# EAGLE schematic ADK_MEGA_2560-REV3 (EAGLE 7.1.0)
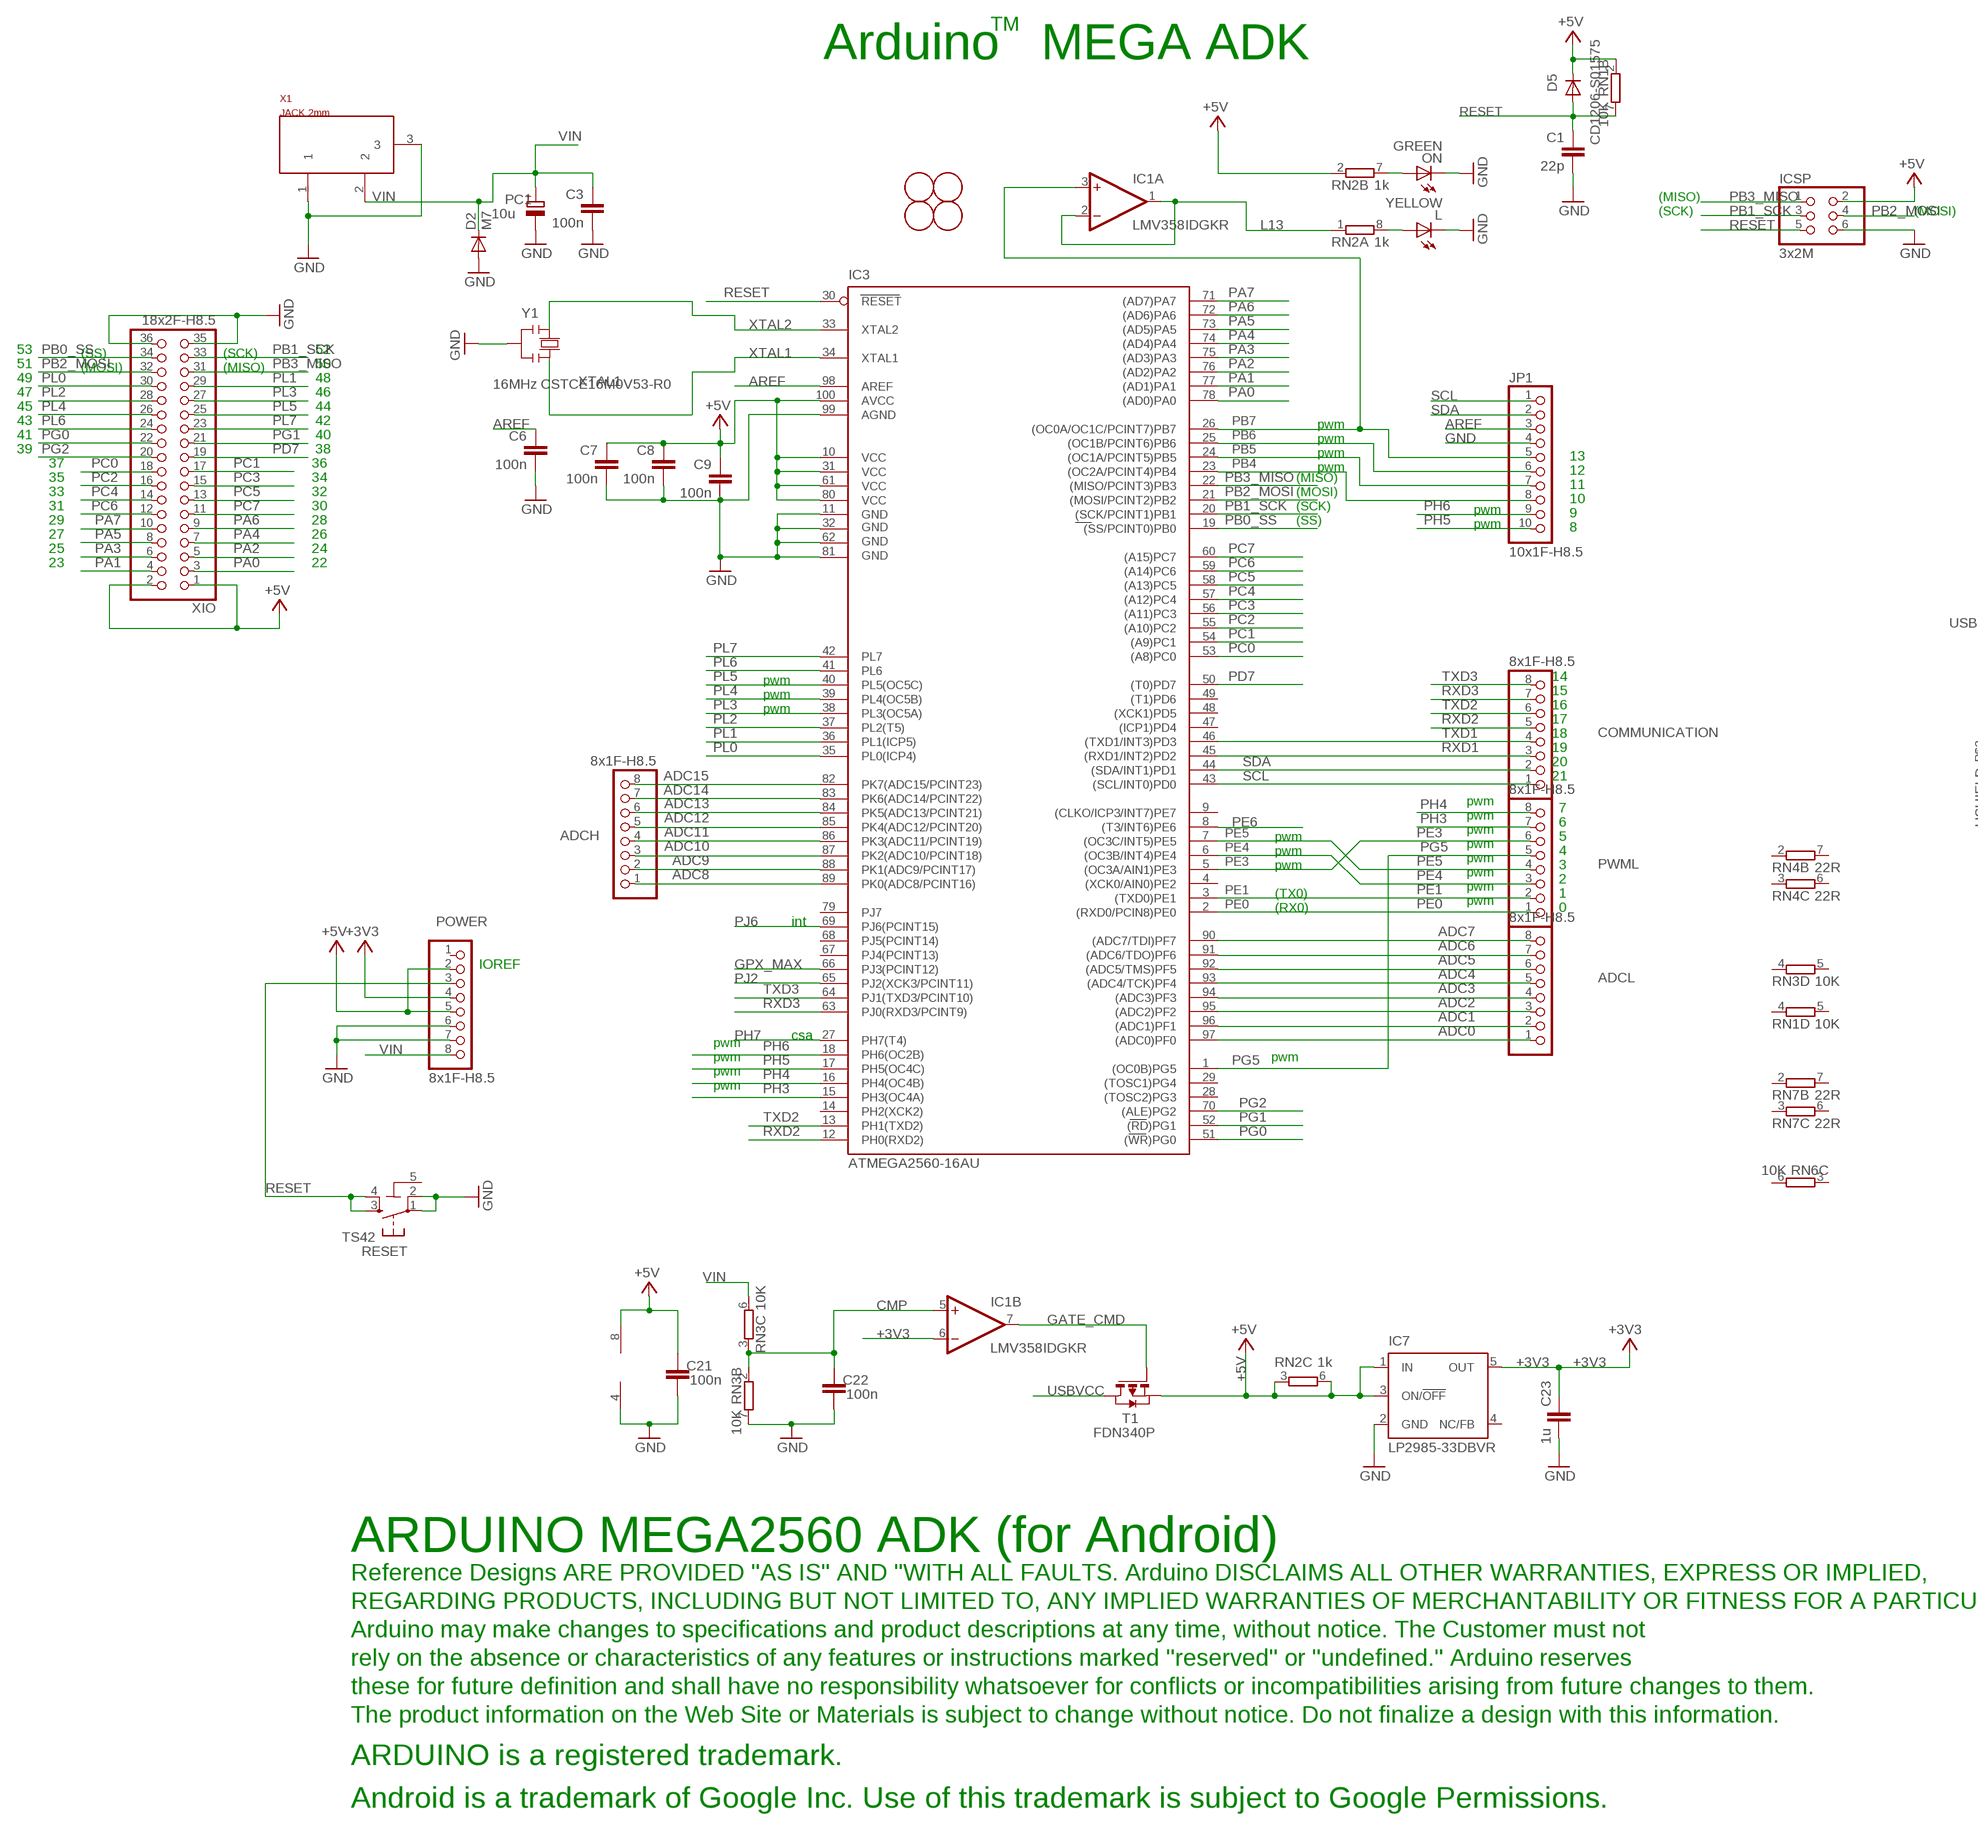
[diagram p0: schematic, sheet 1, part 1 of 2]
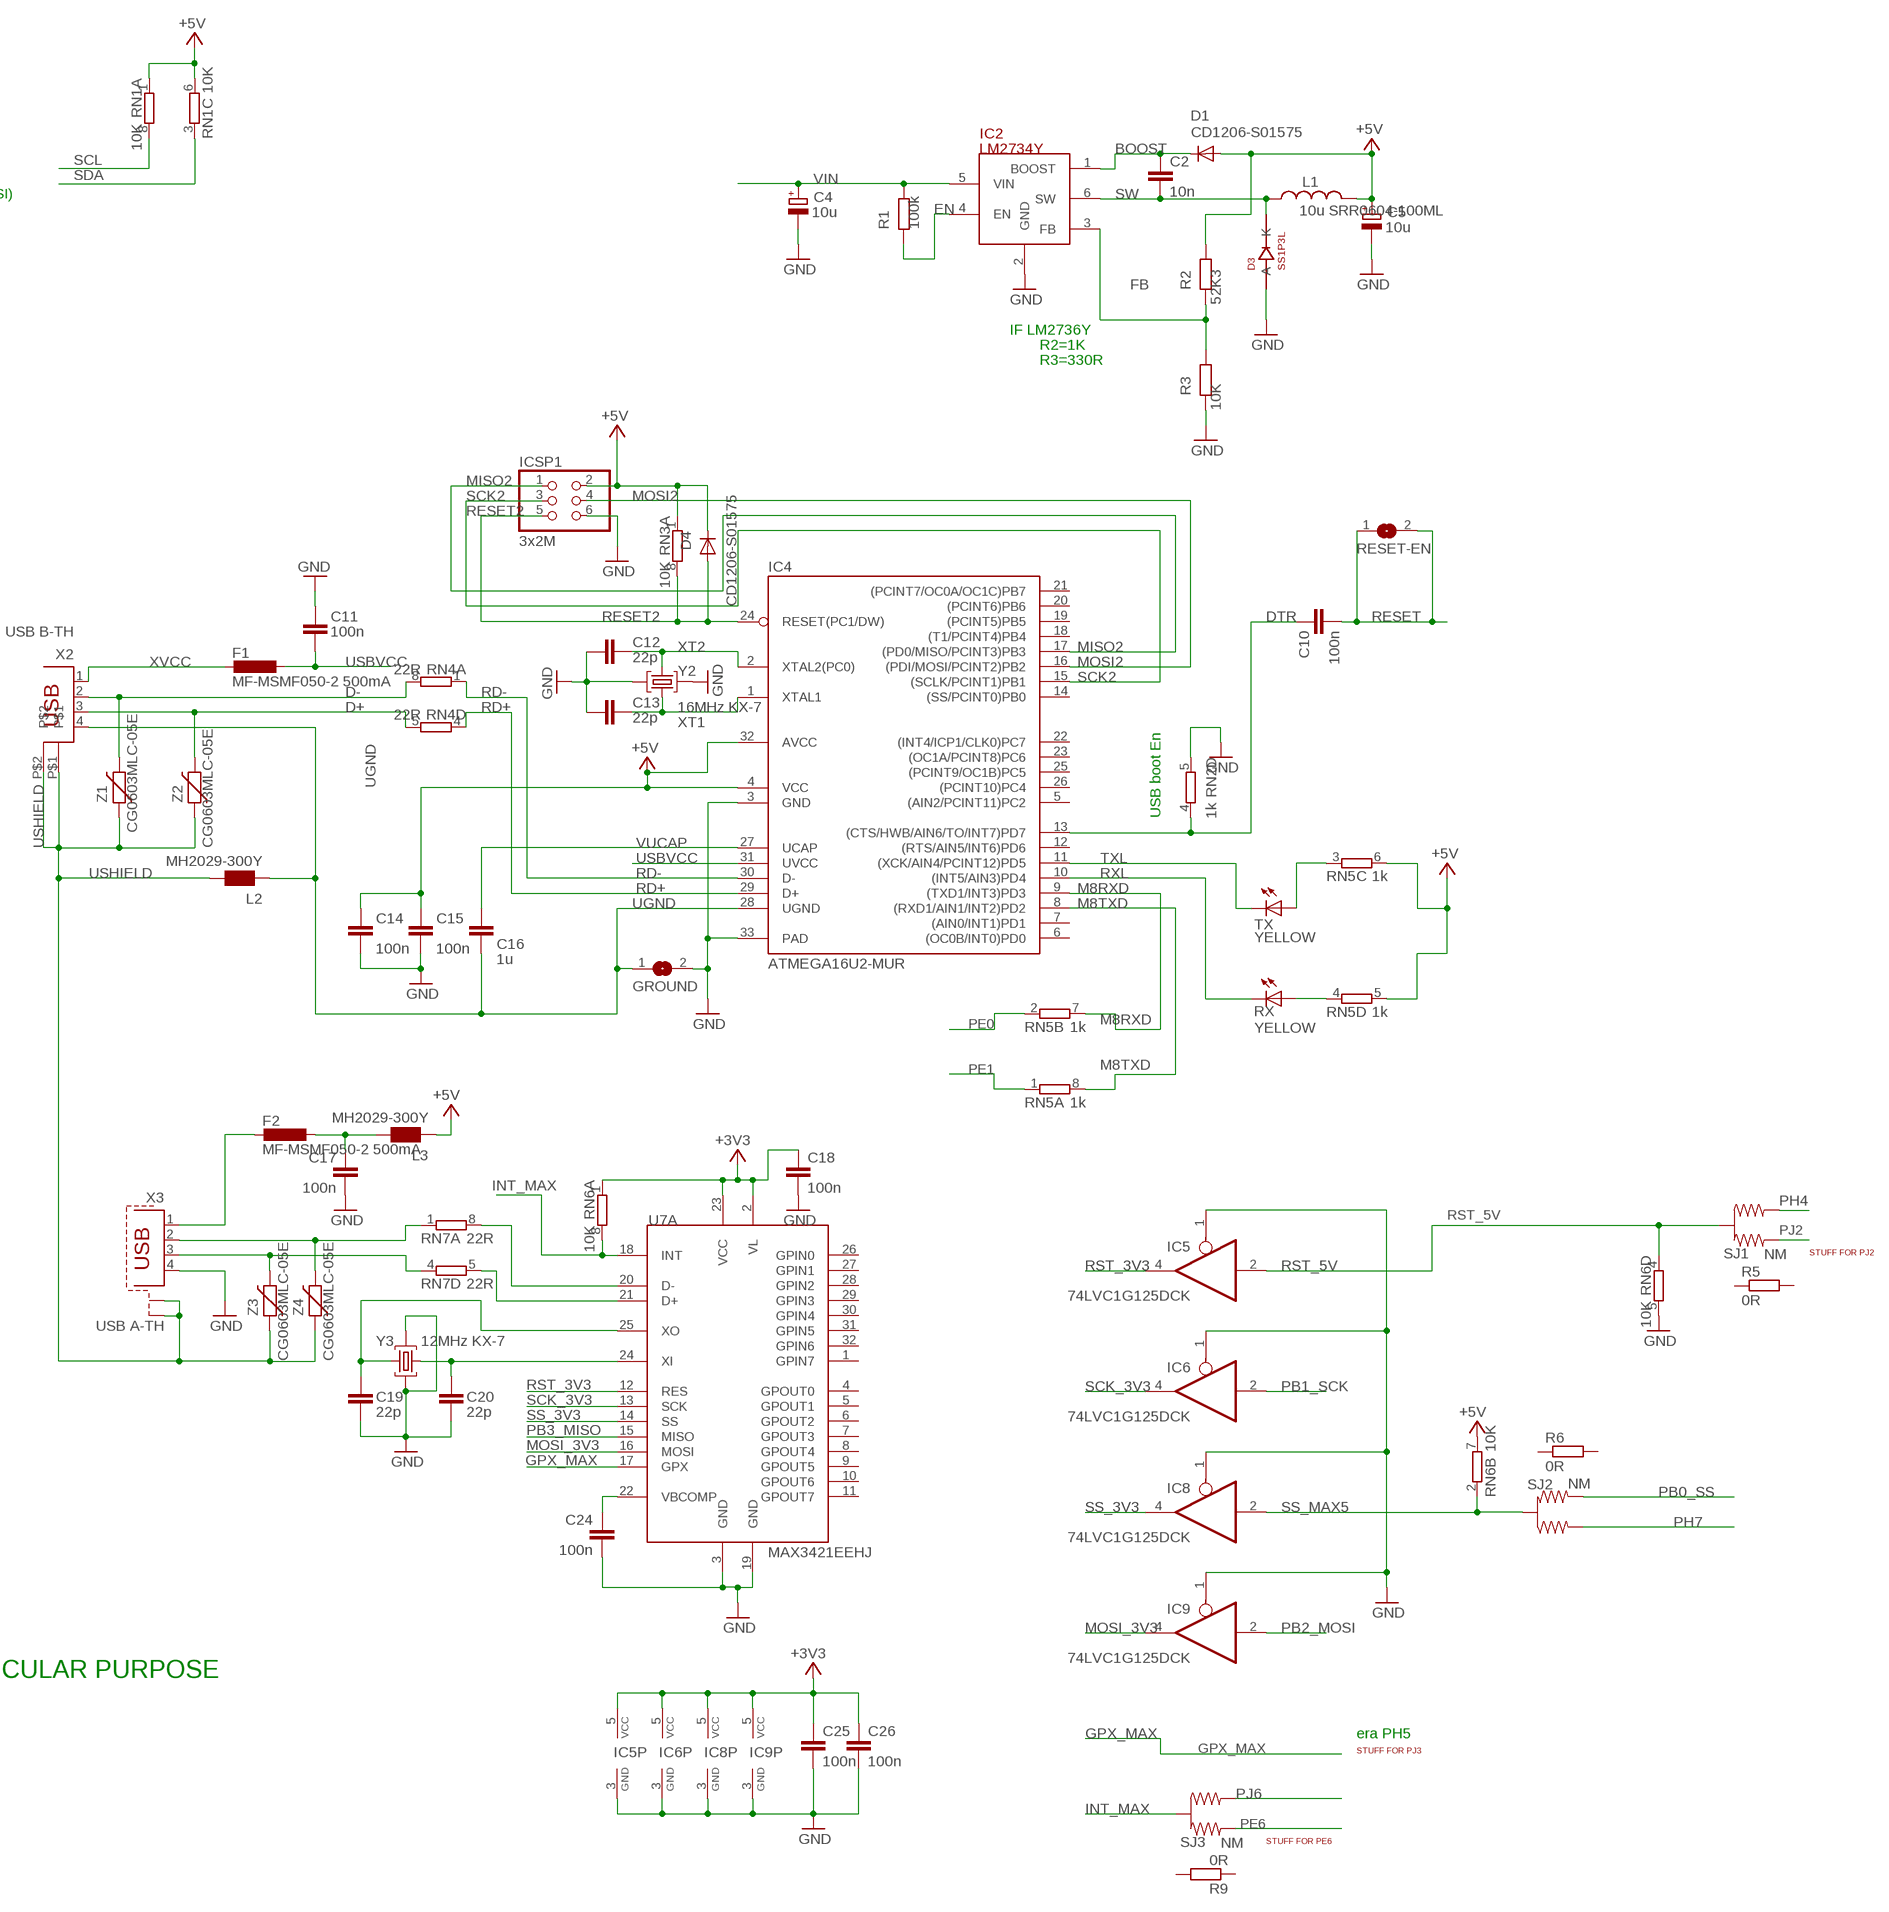
[diagram p1: schematic, sheet 1, part 2 of 2]

## Parts
ADCH  8x1F-H8.5  PINHD-1X8  [1X08]
ADCL  8x1F-H8.5  PINHD-1X8  [1X08]
C1  22p  C-EU0603-RND  [C0603-ROUND]
C2  10n  C-EUC0603  [C0603-ROUND]
C3  100n  C-EU0603-RND  [C0603-ROUND]
C4  10u  CPOL-EUSMCB  [SMC_B]
C5  10u  CPOL-EUSMCB  [SMC_B]
C6  100n  C-EU0603-RND  [C0603-ROUND]
C7  100n  C-EU0603-RND  [C0603-ROUND]
C8  100n  C-EU0603-RND  [C0603-ROUND]
C9  100n  C-EU0603-RND  [C0603-ROUND]
C10  100n  C-EU0603-RND  [C0603-ROUND]
C11  100n  C-EU0603-RND  [C0603-ROUND]
C12  22p  C-EU0603-RND  [C0603-ROUND]
C13  22p  C-EU0603-RND  [C0603-ROUND]
C14  100n  C-EU0603-RND  [C0603-ROUND]
C15  100n  C-EU0603-RND  [C0603-ROUND]
C16  1u  C-EU0603-RND  [C0603-ROUND]
C17  100n  C-EU0603-RND  [C0603-ROUND]
C18  100n  C-EU0603-RND  [C0603-ROUND]
C19  22p  C-EU0603-RND  [C0603-ROUND]
C20  22p  C-EU0603-RND  [C0603-ROUND]
C21  100n  C-EU0603-RND  [C0603-ROUND]
C22  100n  C-EU0603-RND  [C0603-ROUND]
C23  1u  C-EU0603-RND  [C0603-ROUND]
C24  100n  C-EU0603-RND  [C0603-ROUND]
C25  100n  C-EU0603-RND  [C0603-ROUND]
C26  100n  C-EU0603-RND  [C0603-ROUND]
COMMUNICATION  8x1F-H8.5  PINHD-1X8  [1X08]
D1  CD1206-S01575  DIODE-MINIMELF  [MINIMELF]
D2  M7  DIODE-SMB  [SMB]
D3  SS1P3L  [DO220AAL]
D4  CD1206-S01575  DIODE-MINIMELF  [MINIMELF]
D5  CD1206-S01575  DIODE-MINIMELF  [MINIMELF]
F1  MF-MSMF050-2 500mA  L-EUL1812  [L1812]
F2  MF-MSMF050-2 500mA  L-EUL1812  [L1812]
FID1  FIDUCIALMOUNT  [FIDUCIA-MOUNT]
FID2  FIDUCIALMOUNT  [FIDUCIA-MOUNT]
FID3  FIDUCIALMOUNT  [FIDUCIA-MOUNT]
FID4  FIDUCIALMOUNT  [FIDUCIA-MOUNT]
GROUND  SJ  [SJ]
IC1  LMV358IDGKR  LMV358MMX  [MSOP08]
IC2  LM2734Y  LM2736Y  [SOT23-6]
IC3  ATMEGA2560-16AU  ATMEGA25602560-16AU  [TQFP100]
IC4  ATMEGA16U2-MUR  ATMEGA16U2-MU  [MLF32]
IC5  74LVC1G125DCK  [SC70-5]
IC6  74LVC1G125DCK  [SC70-5]
IC7  LP2985-33DBVR  LP2985-XXDBVR33  [SOT23-DBV]
IC8  74LVC1G125DCK  [SC70-5]
IC9  74LVC1G125DCK  [SC70-5]
ICSP  3x2M  PINHD-2X3  [2X03]
ICSP1  3x2M  PINHD-2X3  [2X03]
JP1  10x1F-H8.5  PINHD-1X10  [1X10]
L  YELLOW  LEDCHIP-LED0805  [CHIP-LED0805]
L1  10u SRR0604-100ML  L-USSRR0604  [SRR0604]
L2  MH2029-300Y  WE-CBF_0805  [0805]
L3  MH2029-300Y  WE-CBF_0805  [0805]
ON  GREEN  LEDCHIP-LED0805  [CHIP-LED0805]
PC1  10u  CPOL-EUSMCB  [SMC_B]
POWER  8x1F-H8.5  PINHD-1X8  [1X08]
PWML  8x1F-H8.5  PINHD-1X8  [1X08]
R1  100k  R-EU_0603-RND  [R0603-ROUND]
R2  52K3  R-EU_0603-RND  [R0603-ROUND]
R3  10K  R-EU_0603-RND  [R0603-ROUND]
R5  0R  R-EU_R0402  [R0402]
R6  0R  R-EU_R0402  [R0402]
R9  0R  R-EU_R0402  [R0402]
RESET  TS42  [TS42]
RESET-EN  SJ  [SJ]
RN1  10K  4R-NCAT16  [CAT16]
RN2  1k  4R-NCAY16  [CAY16]
RN3  10K  4R-NCAT16  [CAT16]
RN4  22R  4R-NCAY16  [CAY16]
RN5  1k  4R-NCAY16  [CAY16]
RN6  10K  4R-NCAT16  [CAT16]
RN7  22R  4R-NCAY16  [CAY16]
RX  YELLOW  LEDCHIP-LED0805  [CHIP-LED0805]
SJ1  NM  J0402  [J0402]
SJ2  NM  J0402  [J0402]
SJ3  NM  J0402  [J0402]
T1  FDN340P  PMOSSOT23  [SOT-23]
TX  YELLOW  LEDCHIP-LED0805  [CHIP-LED0805]
U7A  MAX3421EEHJ  [TQFP32-05]
X1  JACK 2mm  POWERSUPPLY_DC21MMX  [POWERSUPPLY_DC-21MM]
X2  USB B-TH  PN61729  [PN61729]
X3  USB A-TH  PN87520-S  [PN87520-S]
XIO  18x2F-H8.5  PINHD-2X18  [2X18]
Y1  16MHz CSTCE16M0V53-R0  RESONATORMU  [RESONATOR]
Y2  16MHz KX-7  CRYSTAL-3.2-2.5  [CRYSTAL-3.2-2.5]
Y3  12MHz KX-7  CRYSTAL-3.2-2.5  [CRYSTAL-3.2-2.5]
Z1  CG0603MLC-05E  VARISTORCN0603  [CT/CN0603]
Z2  CG0603MLC-05E  VARISTORCN0603  [CT/CN0603]
Z3  CG0603MLC-05E  VARISTORCN0603  [CT/CN0603]
Z4  CG0603MLC-05E  VARISTORCN0603  [CT/CN0603]

## Nets
+3V3 [power]: C18.1 C23.2 C25.1 C26.1 IC1.6(B:-IN) IC5.5(VCC) IC6.5(VCC) IC7.5(OUT) IC8.5(VCC) IC9.5(VCC) POWER.4 RN6.1 U7A.2(VL) U7A.23(VCC)
+5V [power usb]: C5.+ C7.1 C8.1 C9.1 C14.1 C15.1 C21.2 D1.A D4.C D5.C IC1.8(P:V+) IC3.10(VCC) IC3.31(VCC1) IC3.61(VCC2) IC3.80(VCC3) IC3.100(AVCC) IC4.4(VCC) IC4.32(AVCC) IC7.1(IN) IC7.3(ON/!OFF) ICSP1.2 ICSP.2 L1.P$2 L3.1 POWER.2 POWER.5 R2.1 RN1.1 RN1.2 RN1.6 RN2.2 RN2.3 RN2.6 RN3.1 RN5.5 RN5.6 RN6.7 T1.2(S) XIO.1 XIO.2
ADC0: ADCL.1 IC3.97((ADC0)PF0)
ADC1: ADCL.2 IC3.96((ADC1)PF1)
ADC2: ADCL.3 IC3.95((ADC2)PF2)
ADC3: ADCL.4 IC3.94((ADC3)PF3)
ADC4: ADCL.5 IC3.93((ADC4/TCK)PF4)
ADC5: ADCL.6 IC3.92((ADC5/TMS)PF5)
ADC6: ADCL.7 IC3.91((ADC6/TDO)PF6)
ADC7: ADCL.8 IC3.90((ADC7/TDI)PF7)
ADC8: ADCH.1 IC3.89(PK0(ADC8/PCINT16))
ADC9: ADCH.2 IC3.88(PK1(ADC9/PCINT17))
ADC10: ADCH.3 IC3.87(PK2(ADC10/PCINT18))
ADC11: ADCH.4 IC3.86(PK3(ADC11/PCINT19))
ADC12: ADCH.5 IC3.85(PK4(ADC12/PCINT20))
ADC13: ADCH.6 IC3.84(PK5(ADC13/PCINT21))
ADC14: ADCH.7 IC3.83(PK6(ADC14/PCINT22))
ADC15: ADCH.8 IC3.82(PK7(ADC15/PCINT23))
AREF: C6.1 IC3.98(AREF) JP1.3
BOOST: C2.1 D1.C IC2.1(BOOST)
CMP: C22.2 IC1.5(B:+IN) RN3.2 RN3.3
D+: RN4.5 X2.3 Z2.2
D-: RN4.8 X2.2 Z1.2
DTR: C10.1 IC4.13((CTS/HWB/AIN6/TO/INT7)PD7) RN2.4
EN: IC2.4(EN) R1.2
FB: IC2.3(FB) R2.2 R3.1
GATE_CMD: IC1.7(B:OUT) T1.3(G)
GND [gnd]: C1.2 C3.2 C4.- C5.- C6.2 C7.2 C8.2 C9.2 C11.2 C12.2 C13.2 C14.2 C15.2 C17.2 C18.2 C19.1 C20.1 C21.1 C22.1 C23.1 C24.2 C25.2 C26.2 D2.A D3.P$2(A) GROUND.2 IC1.4(P:V-) IC2.2(GND) IC3.11(GND) IC3.32(GND1) IC3.62(GND2) IC3.81(GND3) IC3.99(AGND) IC4.3(GND) IC4.33(PAD) IC5.1(OE) IC5.3(GND) IC6.1(OE) IC6.3(GND) IC7.2(GND) IC8.1(OE) IC8.3(GND) IC9.1(OE) IC9.3(GND) ICSP1.6 ICSP.6 JP1.4 L.C ON.C PC1.- POWER.6 POWER.7 R3.2 RESET.1 RESET.2 RN2.5 RN3.7 RN6.5 U7A.3(GND) U7A.19(GND) X1.1 X1.3 X3.4 XIO.35 XIO.36 Y1.2 Y2.2(GND) Y2.4(GND) Y3.2(GND) Y3.4(GND)
GPX_MAX: IC3.66(PJ3(PCINT12)) U7A.17(GPX)
INT_MAX: RN6.8 SJ3.2(C) U7A.18(INT)
L13: IC1.1(A:OUT) IC1.2(A:-IN) RN2.1
M8RXD: IC4.9((TXD1/INT3)PD3) RN5.7
M8TXD: IC4.8((RXD1/AIN1/INT2)PD2) RN5.8
MISO2: IC4.17((PD0/MISO/PCINT3)PB3) ICSP1.1
MOSI2: IC4.16((PDI/MOSI/PCINT2)PB2) ICSP1.4
MOSI_3V3: IC9.4(O) U7A.16(MOSI)
N$2: L.A RN2.8
N$3: ON.A RN2.7
N$10: RN7.1 X3.2 Z4.2
N$11: RN7.4 X3.3 Z3.2
N$12: RN7.8 U7A.20(D-)
N$13: RN7.5 U7A.21(D+)
N$14: F2.2 X3.1
N$15: C20.2 U7A.24(XI) Y3.1(C1)
N$16: C19.2 U7A.25(XO) Y3.3(C2)
N$18: C17.1 F2.1 L3.2
N$39: C24.1 U7A.22(VBCOMP)
N$54: RN5.4 RX.A
N$55: RN5.3 TX.A
PA0: IC3.78((AD0)PA0) XIO.3
PA1: IC3.77((AD1)PA1) XIO.4
PA2: IC3.76((AD2)PA2) XIO.5
PA3: IC3.75((AD3)PA3) XIO.6
PA4: IC3.74((AD4)PA4) XIO.7
PA5: IC3.73((AD5)PA5) XIO.8
PA6: IC3.72((AD6)PA6) XIO.9
PA7: IC3.71((AD7)PA7) XIO.10
PB0_SS: IC3.19((SS/PCINT0)PB0) SJ2.3 XIO.34
PB1_SCK: IC3.20((SCK/PCINT1)PB1) IC6.2(I) ICSP.3 XIO.33
PB2_MOSI: IC3.21((MOSI/PCINT2)PB2) IC9.2(I) ICSP.4 XIO.32
PB3_MISO: IC3.22((MISO/PCINT3)PB3) ICSP.1 U7A.15(MISO) XIO.31
PB4: IC3.23((OC2A/PCINT4)PB4) JP1.8
PB5: IC3.24((OC1A/PCINT5)PB5) JP1.7
PB6: IC3.25((OC1B/PCINT6)PB6) JP1.6
PB7: IC1.3(A:+IN) IC3.26((OC0A/OC1C/PCINT7)PB7) JP1.5
PC0: IC3.53((A8)PC0) XIO.18
PC1: IC3.54((A9)PC1) XIO.17
PC2: IC3.55((A10)PC2) XIO.16
PC3: IC3.56((A11)PC3) XIO.15
PC4: IC3.57((A12)PC4) XIO.14
PC5: IC3.58((A13)PC5) XIO.13
PC6: IC3.59((A14)PC6) XIO.12
PC7: IC3.60((A15)PC7) XIO.11
PD7: IC3.50((T0)PD7) XIO.19
PE0: IC3.2((RXD0/PCIN8)PE0) PWML.1 RN5.2
PE1: IC3.3((TXD0)PE1) PWML.2 RN5.1
PE3: IC3.5((OC3A/AIN1)PE3) PWML.6
PE4: IC3.6((OC3B/INT4)PE4) PWML.3
PE5: IC3.7((OC3C/INT5)PE5) PWML.4
PE6: IC3.8((T3/INT6)PE6) SJ3.3
PG0: IC3.51((WR)PG0) XIO.22
PG1: IC3.52((RD)PG1) XIO.21
PG2: IC3.70((ALE)PG2) XIO.20
PG5: IC3.1((OC0B)PG5) PWML.5
PH3: IC3.15(PH3(OC4A)) PWML.7
PH4: IC3.16(PH4(OC4B)) PWML.8 SJ1.1
PH5: IC3.17(PH5(OC4C)) JP1.10
PH6: IC3.18(PH6(OC2B)) JP1.9
PH7: IC3.27(PH7(T4)) SJ2.1
PJ2: IC3.65(PJ2(XCK3/PCINT11)) SJ1.3
PJ6: IC3.69(PJ6(PCINT15)) SJ3.1
PL0: IC3.35(PL0(ICP4)) XIO.30
PL1: IC3.36(PL1(ICP5)) XIO.29
PL2: IC3.37(PL2(T5)) XIO.28
PL3: IC3.38(PL3(OC5A)) XIO.27
PL4: IC3.39(PL4(OC5B)) XIO.26
PL5: IC3.40(PL5(OC5C)) XIO.25
PL6: IC3.41(PL6) XIO.24
PL7: IC3.42(PL7) XIO.23
RD+: IC4.29(D+) RN4.4
RD-: IC4.30(D-) RN4.1
RESET: C1.1 C10.2 D5.A IC3.30(RESET) ICSP.5 POWER.3 RESET-EN.1 RESET-EN.2 RESET.3 RESET.4 RN1.7
RESET2: D4.A IC4.24(RESET(PC1/DW)) ICSP1.5 RN3.8
RST_3V3: IC5.4(O) U7A.12(RES)
RST_5V: IC5.2(I) RN6.4 SJ1.2(C)
RXD1: COMMUNICATION.3 IC3.45((RXD1/INT2)PD2)
RXD2: COMMUNICATION.5 IC3.12(PH0(RXD2))
RXD3: COMMUNICATION.7 IC3.63(PJ0(RXD3/PCINT9))
RXL: IC4.10((INT5/AIN3)PD4) RX.C
SCK2: IC4.15((SCLK/PCINT1)PB1) ICSP1.3
SCK_3V3: IC6.4(O) U7A.13(SCK)
SCL: COMMUNICATION.1 IC3.43((SCL/INT0)PD0) JP1.1 RN1.8
SDA: COMMUNICATION.2 IC3.44((SDA/INT1)PD1) JP1.2 RN1.3
SS_3V3: IC8.4(O) U7A.14(SS)
SS_MAX5: IC8.2(I) RN6.2 SJ2.2(C)
SW [power]: C2.2 D3.P$1(K) IC2.6(SW) L1.P$1
TXD1: COMMUNICATION.4 IC3.46((TXD1/INT3)PD3)
TXD2: COMMUNICATION.6 IC3.13(PH1(TXD2))
TXD3: COMMUNICATION.8 IC3.64(PJ1(TXD3/PCINT10))
TXL: IC4.11((XCK/AIN4/PCINT12)PD5) TX.C
UGND [gnd]: C16.2 GROUND.1 IC4.28(UGND) L2.1 X2.4
USBVCC [power usb]: C11.1 F1.1 IC4.31(UVCC) T1.1(D)
USHIELD [gnd]: L2.2 X2.P$1 X2.P$2 X3.S1 X3.S2 Z1.1 Z2.1 Z3.1 Z4.1
VIN [power]: C3.1 C4.+ D2.C IC2.5(VIN) PC1.+ POWER.8 R1.1 RN3.6 X1.2
VUCAP: C16.1 IC4.27(UCAP)
XT1: C13.1 IC4.1(XTAL1) Y2.1(C1)
XT2: C12.1 IC4.2(XTAL2(PC0)) Y2.3(C2)
XTAL1: IC3.34(XTAL1) Y1.3
XTAL2: IC3.33(XTAL2) Y1.1
XVCC [power usb]: F1.2 X2.1
Unconnected: IC3.4((XCK0/AIN0)PE2) IC3.9((CLKO/ICP3/INT7)PE7) IC3.14(PH2(XCK2)) IC3.28((TOSC2)PG3) IC3.29((TOSC1)PG4) IC3.47((ICP1)PD4) IC3.48((XCK1)PD5) IC3.49((T1)PD6) IC3.67(PJ4(PCINT13)) IC3.68(PJ5(PCINT14)) IC3.79(PJ7) IC4.5((AIN2/PCINT11)PC2) IC4.6((OC0B/INT0)PD0) IC4.7((AIN0/INT1)PD1) IC4.12((RTS/AIN5/INT6)PD6) IC4.14((SS/PCINT0)PB0) IC4.18((T1/PCINT4)PB4) IC4.19((PCINT5)PB5) IC4.20((PCINT6)PB6) IC4.21((PCINT7/OC0A/OC1C)PB7) IC4.22((INT4/ICP1/CLK0)PC7) IC4.23((OC1A/PCINT8)PC6) IC4.25((PCINT9/OC1B)PC5) IC4.26((PCINT10)PC4) IC7.4(NC/FB) POWER.1 R5.1 R5.2 R6.1 R6.2 R9.1 R9.2 RN1.4 RN1.5 RN3.4 RN3.5 RN4.2 RN4.3 RN4.6 RN4.7 RN6.3 RN6.6 RN7.2 RN7.3 RN7.6 RN7.7 U7A.1(GPIN7) U7A.4(GPOUT0) U7A.5(GPOUT1) U7A.6(GPOUT2) U7A.7(GPOUT3) U7A.8(GPOUT4) U7A.9(GPOUT5) U7A.10(GPOUT6) U7A.11(GPOUT7) U7A.26(GPIN0) U7A.27(GPIN1) U7A.28(GPIN2) U7A.29(GPIN3) U7A.30(GPIN4) U7A.31(GPIN5) U7A.32(GPIN6)

## Notes on the sheet
- TM
- Arduino   MEGA ADK
- (MISO)
- (SCK) | (MOSI)
- IF LM2736Y
- 53 | (SS) | (SCK) | 52 | R2=1K
- 51 | (MOSI) | (MISO) | 50 | R3=330R
- 49 | 48
- 47 | 46
- 45 | 44
- 43 | 42 | pwm
- 41 | 40 | pwm
- 39 | 38 | pwm
- 13
- 37 | 36 | pwm
- 12
- 35 | 34 | (MISO)
- 11
- 33 | 32 | (MOSI)
- 10
- 31 | 30 | (SCK) | pwm
- 9
- 29 | 28 | (SS) | pwm
- 8
- 27 | 26
- 25 | 24
- 23 | 22
- pwm | 14
- pwm | 15
- pwm | 16
- 17
- 18
- 19
- 20
- 21
- USB boot En
- pwm
- 7
- pwm
- 6
- pwm
- pwm | 5
- pwm
- pwm | 4
- pwm
- pwm | 3
- pwm
- 2
- pwm
- (TX0) | 1
- pwm
- (RX0) | 0
- int
- IOREF
- csa
- pwm
- pwm | pwm
- pwm
- pwm
- STUFF FOR PJ2
- ARDUINO MEGA2560 ADK (for Android)
- Reference Designs ARE PROVIDED "AS IS" AND "WITH ALL FAULTS. Arduino DISCLAIMS ALL OTHER WARRANTIES, EXPRESS OR IMPLIED,
- REGARDING PRODUCTS, INCLUDING BUT NOT LIMITED TO, ANY IMPLIED WARRANTIES OF MERCHANTABILITY OR FITNESS FOR A PARTICULAR PURPOSE
- Arduino may make changes to specifications and product descriptions at any time, without notice. The Customer must not
- rely on the absence or characteristics of any features or instructions marked "reserved" or "undefined." Arduino reserves | era PH5
- STUFF FOR PJ3
- these for future definition and shall have no responsibility whatsoever for conflicts or incompatibilities arising from future changes to them.
- The product information on the Web Site or Materials is subject to change without notice. Do not finalize a design with this information.
- ARDUINO is a registered trademark. | STUFF FOR PE6
- Android is a trademark of Google Inc. Use of this trademark is subject to Google Permissions.

## Power pins joined to a net without a drawn wire
5-GND: RESET.5(5-GND)

## Library data of the parts
ADCH ADCL COMMUNICATION POWER PWML = SmartPrj:PINHD-1X8: PIN HEADER
C1-C3 C6-C26 = SmartPrj:C-EU: CAPACITOR, European symbol
C4 C5 PC1 = rcl:CPOL-EU: POLARIZED CAPACITOR, European symbol
D1 D2 D4 D5 = diode:DIODE-: DIODE
D3 = SmartPrj:SS1P3L
F1 F2 = rcl:L-EU: INDUCTOR, European symbol
FID1-FID4 = SmartPrj:FIDUCIALMOUNT
GROUND RESET-EN = jumper:SJ: SMD solder JUMPER
IC1 = linear:LMV358?*: Dual General Purpose, Low Voltage, Rail-to-Rail Output Operational Amplifiers Source: http://www.national.com/mpf/LM/LMV321.html http://www.national.com/dt/lmv_qual.pdf
IC2 = SmartPrj:LM2736Y
IC3 = SmartPrj:ATMEGA2560: MICROCONTROLLER 64/128/256 Kbytes FLASH 4 Kbytes EEPROM 8 Kbytes SRAM 86 General Purpose I/O pins 12-channels16-bit PWM 4 x Serial USARTs 16-channels 10-bit A/D
IC4 = SmartPrj:ATMEGA16U2-
IC5 IC6 IC8 IC9 = 74xx-little-us:74*1G125: Single Bus Buffer Gate with 3-State Output
IC7 = SmartPrj:LP2985-XXDBVR: ULTRALOW-POWER 50-mA LOW-DROPOUT LINEAR REGULATORS 50-mA Low-Dropout Regulator Source: http://focus.ti.com/lit/ds/symlink/tps77001.pdf
ICSP ICSP1 = SmartPrj:PINHD-2X3: PIN HEADER
JP1 = SmartPrj:PINHD-1X10: PIN HEADER
L ON RX TX = led:LED: LED OSRAM: - CHIPLED LG R971, LG N971, LY N971, LG Q971, LY Q971, LO R971, LY R971 LH N974, LH R974 LS Q976, LO Q976, LY Q976 LO Q996 - Hyper CHIPLED LW Q18S LB Q993, LB Q99A, LB R99A - SideLED LS A670, LO A670, LY A670, LG A670, LP A670 LB A673, LV A673, LT A673, LW A673 LH A674 LY A675 LS A676, LA A676, LO A676, LY A676, LW A676 LS A679, LY A679, LG A679 - Hyper Micro SIDELED® LS Y876, LA Y876, LO Y876, LY Y876 LT Y87S - SmartLED LW L88C, LW L88S LB L89C, LB L89S, LG L890 LS L89K, LO L89K, LY L89K LS L896, LA L896, LO L896, LY L896 - TOPLED LS T670, LO T670, LY T670, LG T670, LP T670 LSG T670, LSP T670, LSY T670, LOP T670, LYG T670 LG T671, LOG T671, LSG T671 LB T673, LV T673, LT T673, LW T673 LH T674 LS T676, LA T676, LO T676, LY T676, LB T676, LH T676, LSB T676, LW T676 LB T67C, LV T67C, LT T67C, LS T67K, LO T67K, LY T67K, LW E67C LS E67B, LA E67B, LO E67B, LY E67B, LB E67C, LV E67C, LT E67C LW T67C LS T679, LY T679, LG T679 LS T770, LO T770, LY T770, LG T770, LP T770 LB T773, LV T773, LT T773, LW T773 LH T774 LS E675, LA E675, LY E675, LS T675 LS T776, LA T776, LO T776, LY T776, LB T776 LHGB T686 LT T68C, LB T68C - Hyper Mini TOPLED® LB M676 - Mini TOPLED Santana® LG M470 LS M47K, LO M47K, LY M47K Source: http://www.osram.convergy.de LUXEON: - LUMILED® LXK2-PW12-R00, LXK2-PW12-S00, LXK2-PW14-U00, LXK2-PW14-V00 LXK2-PM12-R00, LXK2-PM12-S00, LXK2-PM14-U00 LXK2-PE12-Q00, LXK2-PE12-R00, LXK2-PE12-S00, LXK2-PE14-T00, LXK2-PE14-U00 LXK2-PB12-K00, LXK2-PB12-L00, LXK2-PB12-M00, LXK2-PB14-N00, LXK2-PB14-P00, LXK2-PB14-Q00 LXK2-PR12-L00, LXK2-PR12-M00, LXK2-PR14-Q00, LXK2-PR14-R00 LXK2-PD12-Q00, LXK2-PD12-R00, LXK2-PD12-S00 LXK2-PH12-R00, LXK2-PH12-S00 LXK2-PL12-P00, LXK2-PL12-Q00, LXK2-PL12-R00 Source: www.luxeon.com KINGBRIGHT: KA-3528ASYC Source: www.kingbright.com
L1 = SmartPrj:L-US: INDUCTOR, American symbol
L2 L3 = wuerth-elektronik:WE-CBF: SMD EMI Suppression Ferrite Beads - excellent anti-EMI properties - low DCR - impedances till 3000 ohms - rated current up to 6 A
R1-R3 R5 R6 R9 = SmartPrj:R-EU_: RESISTOR, European symbol
RESET = SmartPrj:TS42: TS42 Dongnan Electronics Tact switch VDC 12V - 50mA
RN1-RN7 = resistor-dil:4R-N: Array Chip Resistor Source: RS Component / Phycomp
SJ1-SJ3 = bibaja:J: Three terminal jumper made from two 0402, 0603, 0805, etc.
T1 = zetex:PMOSSOT23: MOS FET
U7A = bibaja:MAX3421EE: MAX3421 SPI to USB Interface Chip
X1 = SmartPrj:POWERSUPPLY_DC21MM
X2 = SmartPrj:PN61729: BERG USB connector
X3 = SmartPrj:PN87520-S
XIO = SmartPrj:PINHD-2X18: PIN HEADER
Y1 = SmartPrj:RESONATOR
Y2 Y3 = SmartPrj:CRYSTAL-3.2-2.5
Z1-Z4 = varistor:VARISTOR: VARISTOR

## Net classes
0 default: width 0.203 mm, drill 0.406 mm, clearance 0.178 mm
1 power: width 0.305 mm, drill 0.406 mm, clearance 0.178 mm
2 gnd: width 0.305 mm, drill 0.406 mm, clearance 0.178 mm
3 power usb: width 0.508 mm, drill 0.406 mm, clearance 0.178 mm